# Altium schematic sheet Sheet1.SchDoc
size A3; SheetNumber: 1; SheetTotal: 2
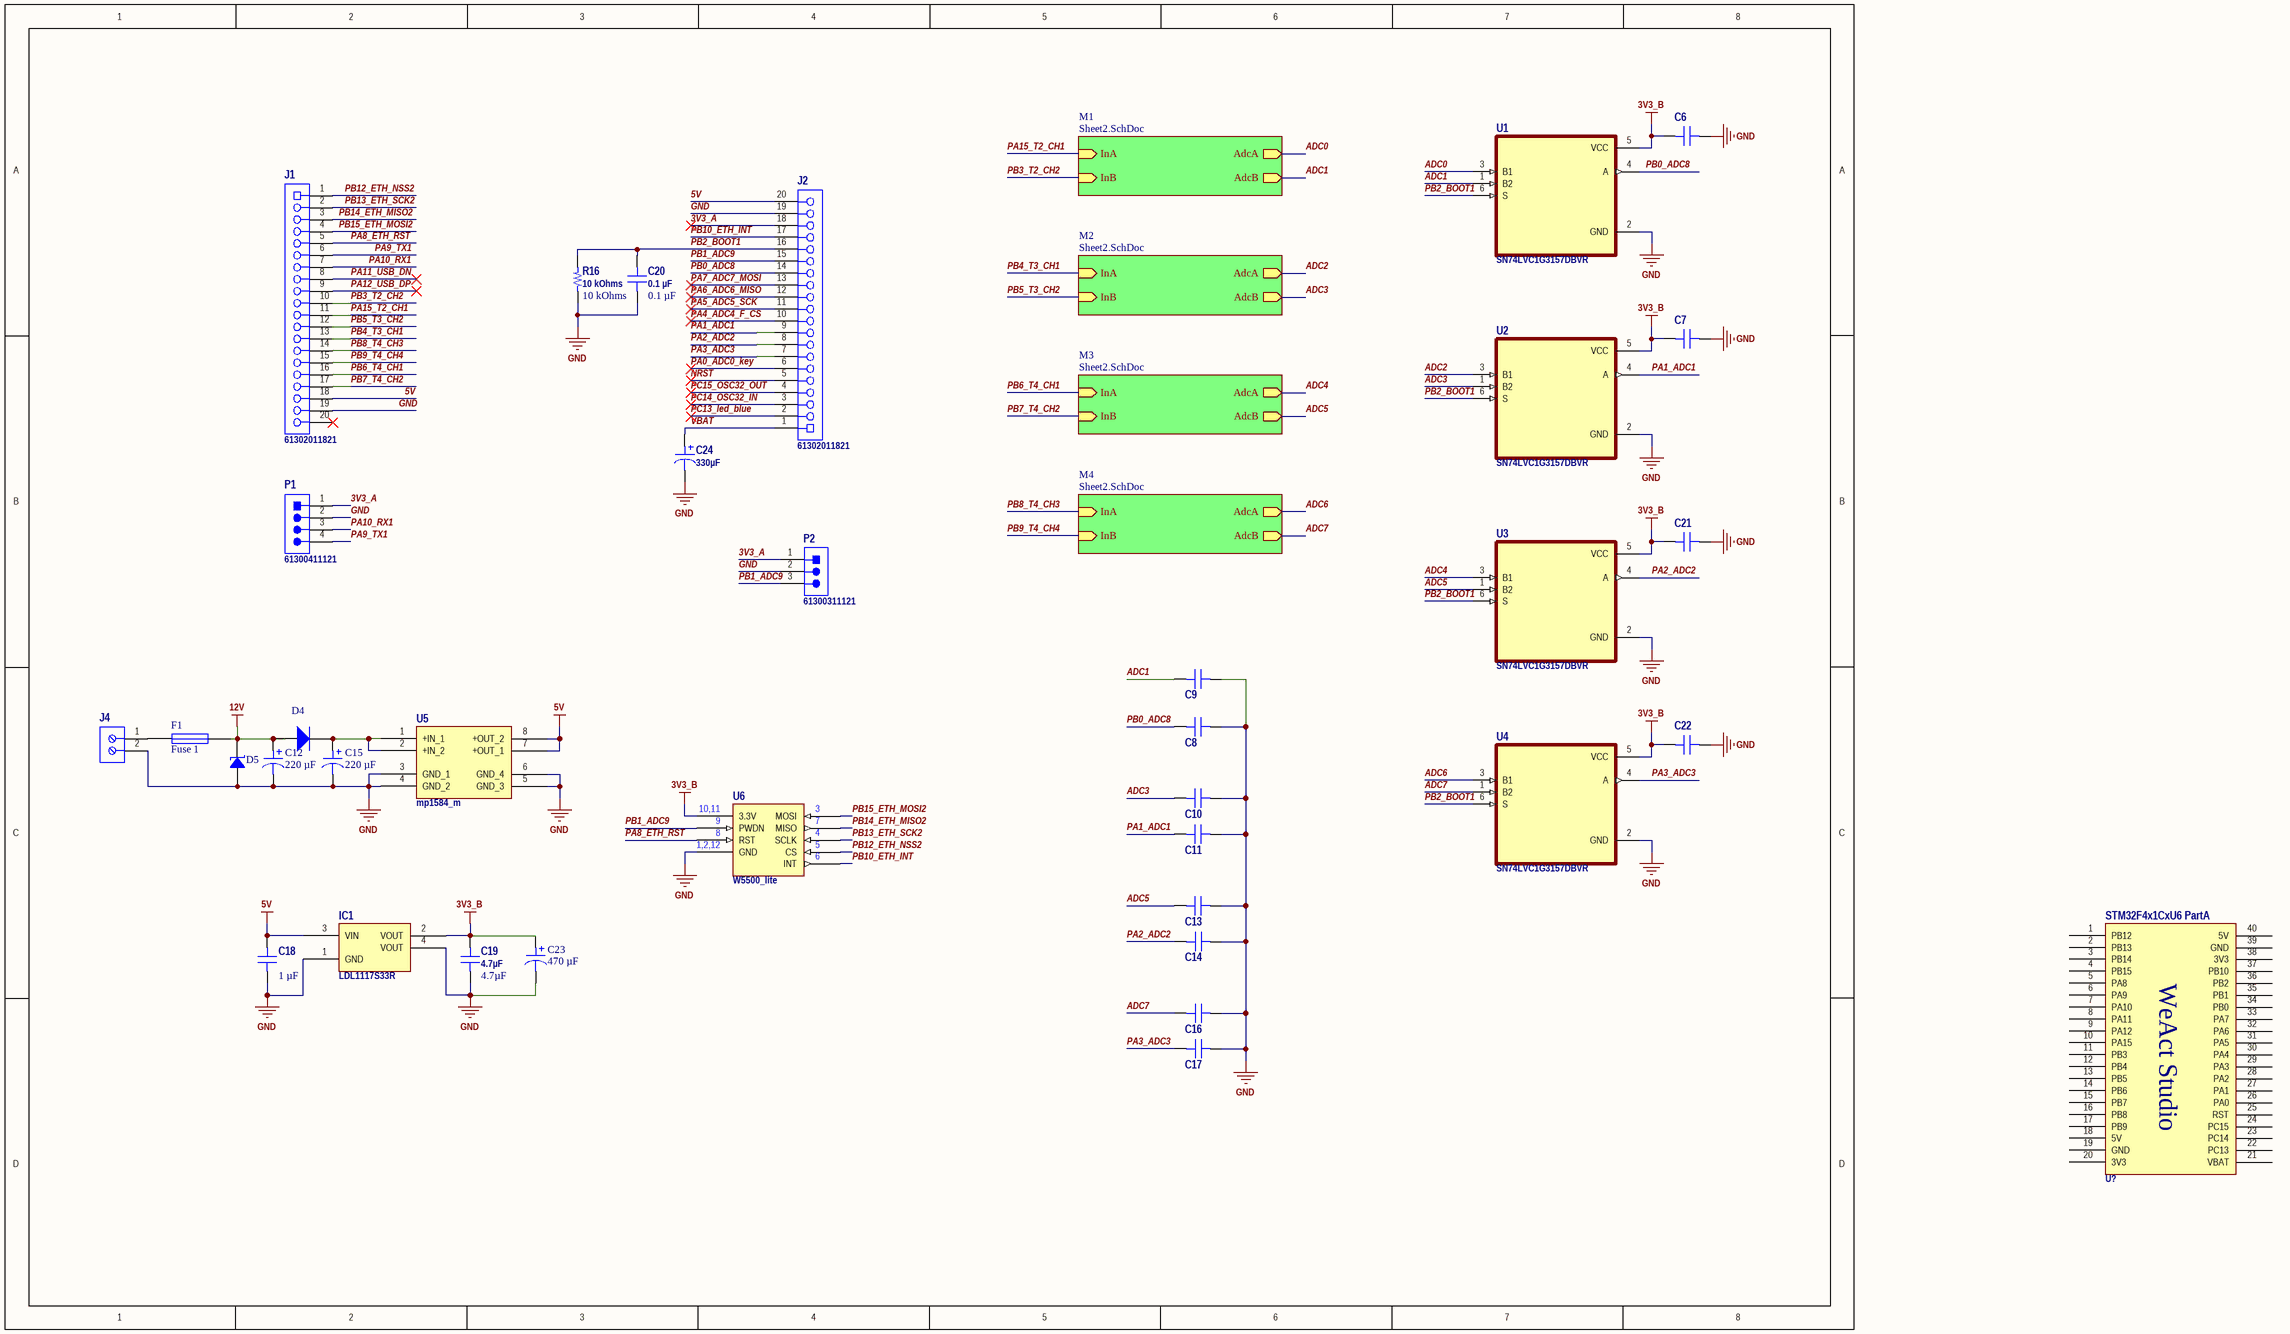
[diagram p0: Sheet1.SchDoc]

## Parts
C6  1000 pF  [CAP 0603_1608]  (value not drawn)
C7  1000 pF  [CAP 0603_1608]  (value not drawn)
C8  0.1 µF  [CAP 0603_1608]  (value not drawn)
C9  0.1 µF  [CAP 0603_1608]  (value not drawn)
C10  0.1 µF  [CAP 0603_1608]  (value not drawn)
C11  0.1 µF  [CAP 0603_1608]  (value not drawn)
C12  220 µF  [CAP AL TH D8 L3.5 H12.5]
C13  0.1 µF  [CAP 0603_1608]  (value not drawn)
C14  0.1 µF  [CAP 0603_1608]  (value not drawn)
C15  220 µF  [CAP AL TH D8 L3.5 H12.5]
C16  0.1 µF  [CAP 0603_1608]  (value not drawn)
C17  0.1 µF  [CAP 0603_1608]  (value not drawn)
C18  1 µF  [CAP 0805_2012]
C19  4.7µF  [CAP 0805_2012]
C20  0.1 µF  [CAP 0603_1608]
C21  1000 pF  [CAP 0603_1608]  (value not drawn)
C22  1000 pF  [CAP 0603_1608]  (value not drawn)
C23  470 µF  [CAP AL TH D8 L3.5 H12.5]
C24  330µF  [CAP POL 2917_7343]
D4  Diode 1N5400  [DO-201AD]  (value not drawn)
D5  SMBJ120A  [DO214AA SMB]  (value not drawn)
F1  Fuse 1  [PIN-W2/E2.8]
IC1  LDL1117S33R  [ST SOT-223]
J1  61302011821  [61302011821]
J2  61302011821  [61302011821]
J4  691102710002  [691102710002]  (value not drawn)
P1  61300411121  [61300411121]
P2  61300311121  [61300311121]
R16  10 kOhms  [RES 0805_2012]
STM32F4x1CxU6_Part  U?  [STM32F4x1CxU6 WeActStudio]  (part A of 2)
U1  SN74LVC1G3157DBVR  [SOT95P280X145-6N]
U2  SN74LVC1G3157DBVR  [SOT95P280X145-6N]
U3  SN74LVC1G3157DBVR  [SOT95P280X145-6N]
U4  SN74LVC1G3157DBVR  [SOT95P280X145-6N]
U5  mp1584_m  [modul]
U6  W5500_lite  [VAD USR-ES1 W5500]

## Sub-sheets
M1 = Sheet2.SchDoc: InA (in), InB (in), AdcB (out), AdcA (out)
M2 = Sheet2.SchDoc: InA (in), InB (in), AdcB (out), AdcA (out)
M3 = Sheet2.SchDoc: InA (in), InB (in), AdcB (out), AdcA (out)
M4 = Sheet2.SchDoc: InA (in), InB (in), AdcB (out), AdcA (out)

## Nets
3V3_B: C6.2 C7.2 C19.2 C21.2 C22.2 C23.1 IC1.2(VOUT) U1.5(VCC) U2.5(VCC) U3.5(VCC) U4.5(VCC) U6.10,11(3.3V)
5V: C18.2 IC1.3(VIN) J1.18 J2.20 U5.7(+OUT_1) U5.8(+OUT_2)
12V: C12.1 D4.1(A) D5.2 F1.2
GND: C6.1 C7.1 C8.2 C9.2 C10.2 C11.2 C12.2 C13.2 C14.1 C15.2 C16.1 C17.1 C18.1 C19.1 C20.2 C21.1 C22.1 C23.2 C24.2 D5.1 IC1.1(GND) IC1.4(VOUT) J1.19 J2.19 J4.2 P1.2 P2.2 R16.1 U1.2(GND) U2.2(GND) U3.2(GND) U4.2(GND) U5.3(GND_1) U5.4(GND_2) U5.5(GND_3) U5.6(GND_4) U6.1,2,12(GND)
3V3_A: J2.18 P1.1 P2.1
ADC0: U1.3(B1) ; sheet M1/AdcA
ADC1: C9.1 U1.1(B2) ; sheet M1/AdcB
ADC2: U2.3(B1) ; sheet M2/AdcA
ADC3: C10.1 U2.1(B2) ; sheet M2/AdcB
ADC4: U3.3(B1) ; sheet M3/AdcA
ADC5: C13.1 U3.1(B2) ; sheet M3/AdcB
ADC6: U4.3(B1) ; sheet M4/AdcA
ADC7: C16.2 U4.1(B2) ; sheet M4/AdcB
NRST: J2.5
PA0_ADC0_key: J2.6
PA1_ADC1: C11.1 J2.9 U2.4(A)
PA2_ADC2: C14.2 J2.8 U3.4(A)
PA3_ADC3: C17.2 J2.7 U4.4(A)
PA4_ADC4_F_CS: J2.10
PA5_ADC5_SCK: J2.11
PA6_ADC6_MISO: J2.12
PA7_ADC7_MOSI: J2.13
PA8_ETH_RST: J1.5 U6.8(RST)
PA9_TX1: J1.6 P1.4
PA10_RX1: J1.7 P1.3
PA11_USB_DN: J1.8
PA12_USB_DP: J1.9
PA15_T2_CH1: J1.11 ; sheet M1/InA
PB0_ADC8: C8.1 J2.14 U1.4(A)
PB1_ADC9: J2.15 P2.3 U6.9(PWDN)
PB2_BOOT1: C20.1 J2.16 R16.2 U1.6(S) U2.6(S) U3.6(S) U4.6(S)
PB3_T2_CH2: J1.10 ; sheet M1/InB
PB4_T3_CH1: J1.13 ; sheet M2/InA
PB5_T3_CH2: J1.12 ; sheet M2/InB
PB6_T4_CH1: J1.16 ; sheet M3/InA
PB7_T4_CH2: J1.17 ; sheet M3/InB
PB8_T4_CH3: J1.14 ; sheet M4/InA
PB9_T4_CH4: J1.15 ; sheet M4/InB
PB10_ETH_INT: J2.17 U6.6(INT)
PB12_ETH_NSS2: J1.1 U6.5(CS)
PB13_ETH_SCK2: J1.2 U6.4(SCLK)
PB14_ETH_MISO2: J1.3 U6.7(MISO)
PB15_ETH_MOSI2: J1.4 U6.3(MOSI)
PC13_led_blue: J2.2
PC14_OSC32_IN: J2.3
PC15_OSC32_OUT: J2.4
VBAT: C24.1 J2.1
NetC15_1: C15.1 D4.2(K) U5.1(+IN_1) U5.2(+IN_2)
NetF1_1: F1.1 J4.1

Not connected (* = marked no-connect by the designer): J1 20*; STM32F4x1CxU6_Part 1(PB12) 2(PB13) 3(PB14) 4(PB15) 5(PA8) 6(PA9) 7(PA10) 8(PA11) 9(PA12) 10(PA15) 11(PB3) 12(PB4) 13(PB5) 14(PB6) 15(PB7) 16(PB8) 17(PB9) 18(5V) 19(GND) 20(3V3) 21(VBAT) 22(PC13) 23(PC14) 24(PC15) 25(RST) 26(PA0) 27(PA1) 28(PA2) 29(PA3) 30(PA4) 31(PA5) 32(PA6) 33(PA7) 34(PB0) 35(PB1) 36(PB2) 37(PB10) 38(3V3) 39(GND) 40(5V)

## Library data of the parts
C6 C7 C21 C22 = CC0603JPX7R9BB102: CAP CER 1000PF 50V X7R 0603; manufacturer: Yageo; Tolerance: ±5%; Part Number: CC0603JPX7R9BB102; Value: 1000 pF; Applications: General Purpose; Capacitance: 1000 pF; componentlink1description: Datasheet; componentlink1url: https://www.yageo.com/upload/media/product/productsearch/datasheet/mlcc/UPY-GPHC_X7R_6.3V-to-50V_20.pdf; componentlink2description: DigiKey Link; componentlink2url: https://www.digikey.com/en/products/detail/yageo/CC0603JPX7R9BB102/11490764; Device Package: 0603 (1608 Metric); lastupdated: 26.02.2022 9:05:02; Lifecycle Status: Active; Minimum Order: 1; Mounting Type: Surface Mount, MLCC; Operating Temperature: -55°C ~ 125°C; Package / Case: 0603 (1608 Metric); packaging: TapeAndReel; partid: 35065; Part Status: Active; price: 0.01; series: CC; Size / Dimension: 0.063" L x 0.031" W (1.60mm x 0.80mm); Supplier 1: DigiKey; Supplier Part Number 1: 13-CC0603JPX7R9BB102CT-ND; Temperature Coefficient: X7R; Thickness (Max): 0.035" (0.90mm); Voltage - Rated: 50V
C8-C11 C13 C14 C16 C17 = CC0603KPX7R8BB104: CAP CER 0.1UF 25V X7R 0603; manufacturer: Yageo; Tolerance: ±10%; Part Number: CC0603KPX7R8BB104; Value: 0.1 µF; Applications: General Purpose; Capacitance: 0.1 µF; componentlink1description: Datasheet; componentlink1url: https://www.yageo.com/upload/media/product/productsearch/datasheet/mlcc/UPY-GPHC_X7R_6.3V-to-50V_20.pdf; componentlink2description: DigiKey Link; componentlink2url: https://www.digikey.com/en/products/detail/yageo/CC0603KPX7R8BB104/11491262; Device Package: 0603 (1608 Metric); lastupdated: 06.03.2022 13:58:12; Lifecycle Status: Active; Minimum Order: 1; Mounting Type: Surface Mount, MLCC; Operating Temperature: -55°C ~ 125°C; Package / Case: 0603 (1608 Metric); packaging: TapeAndReel; partid: 35805; Part Status: Active; price: 0.01; series: CC; Size / Dimension: 0.063" L x 0.031" W (1.60mm x 0.80mm); Supplier 1: DigiKey; Supplier Part Number 1: 13-CC0603KPX7R8BB104CT-ND; Temperature Coefficient: X7R; Thickness (Max): 0.035" (0.90mm); Voltage - Rated: 25V
C12 C15 = ESW227M025AG3AA: CAP ALUM 220UF 20% 25V RADIAL; manufacturer: KEMET; ESR (Equivalent Series Resistance): 117mOhm @ 100kHz; Impedance: 117 mOhms; Lifetime @ Temp.: 4000 Hrs @ 105°C; Polarization: Polar; Ripple Current @ High Frequency: 640 mA @ 100 kHz; Ripple Current @ Low Frequency: 320 mA @ 120 Hz; Part Number: ESW227M025AG3AA; Applications: General Purpose; Capacitance: 220 µF; componentlink1description: Datasheet; componentlink1url: https://api.kemet.com/component-edge/download/datasheet/ESW227M025AG3AA.pdf; componentlink2description: DigiKey Link; componentlink2url: https://www.digikey.com/en/products/detail/kemet/ESW227M025AG3AA/2712542; Device Package: Radial, Can; Height - Seated (Max): 0.492" (12.50mm); lastupdated: 11.07.2022 15:34:44; Lead Spacing: 0.138" (3.50mm); Lifecycle Status: Active; Minimum Order: 1; Mounting Type: Through Hole; Operating Temperature: -40°C ~ 105°C; Package / Case: Radial, Can; packaging: Bulk; partid: 7223; Part Status: Active; price: 0.12; series: ESW; Size / Dimension: 0.315" Dia (8.00mm); Supplier 1: DigiKey; Supplier Part Number 1: 399-6112-ND; Tolerance: ±20%; value: 220 µF; Voltage - Rated: 25 V
C18 = CL21B105KBFNNNE: CAP CER 1UF 50V X7R 0805; manufacturer: Samsung Electro-Mechanics; Tolerance: ±10%; Part Number: CL21B105KBFNNNE; Value: 1 µF; Applications: General Purpose; Capacitance: 1 µF; componentlink1description: Datasheet; componentlink1url: http://www.samsungsem.com/kr/support/product-search/mlcc/CL21B105KBFNNNE.jsp; componentlink2description: DigiKey Link; componentlink2url: https://www.digikey.com/en/products/detail/samsung-electro-mechanics/CL21B105KBFNNNE/3886687; Device Package: 0805 (2012 Metric); lastupdated: 27.06.2022 11:05:28; Lifecycle Status: Active; Minimum Order: 1; Mounting Type: Surface Mount, MLCC; Operating Temperature: -55°C ~ 125°C; Package / Case: 0805 (2012 Metric); packaging: TapeAndReel; partid: 39620; Part Status: Active; price: 0.02; series: CL; Size / Dimension: 0.079" L x 0.049" W (2.00mm x 1.25mm); Supplier 1: DigiKey; Supplier Part Number 1: 1276-1029-1-ND; Temperature Coefficient: X7R; Thickness (Max): 0.053" (1.35mm); Voltage - Rated: 50V
C19 = 08056D475KAT2A: CAP CER 4.7UF 6.3V X5R 0805; manufacturer: AVX Corporation; Tolerance: ±10%; Part Number: 08056D475KAT2A; Value: 4.7µF; Applications: General Purpose; Capacitance: 4.7µF; componentlink1description: Datasheet; componentlink1url: http://datasheets.avx.com/cx5r.pdf; componentlink2description: DigiKey Link; componentlink2url: http://digikey.com/product-detail/en/avx-corporation/08056D475KAT2A/478-1416-1-ND/564448; Device Package: 0805 (2012 Metric); lastupdated: 02.09.2020 1:04:16; Lifecycle Status: Active; Minimum Order: 1; Mounting Type: Surface Mount, MLCC; Operating Temperature: -55°C ~ 85°C; Package / Case: 0805 (2012 Metric); packaging: TapeAndReel; partid: 15246; Part Status: Active; price: 0.13; series: -; Size / Dimension: 0.079" L x 0.049" W (2.01mm x 1.25mm); Supplier 1: DigiKey; Supplier Part Number 1: 478-1416-1-ND; Temperature Coefficient: X5R; Thickness (Max): 0.055" (1.40mm); Voltage - Rated: 6.3V
C20 = CS0603KRX7R7BB104: CAP CER 0.1UF 16V X7R 0603; manufacturer: Yageo; Tolerance: ±10%; Part Number: CS0603KRX7R7BB104; Value: 0.1 µF; Applications: Boardflex Sensitive; Capacitance: 0.1 µF; componentlink1description: Datasheet; componentlink1url: http://www.yageo.com/NewPortal/yageodocoutput?fileName=/pdf/MLCC/UPY-ST_NPOX7R_16V-to-3KV_5.pdf; componentlink2description: DigiKey Link; componentlink2url: https://www.digikey.com/en/products/detail/yageo/CS0603KRX7R7BB104/6097897; Device Package: 0603 (1608 Metric); Features: Soft Termination; lastupdated: 30.06.2022 22:03:44; Lifecycle Status: Active; Minimum Order: 1; Mounting Type: Surface Mount, MLCC; Operating Temperature: -55°C ~ 125°C; Package / Case: 0603 (1608 Metric); packaging: TapeAndReel; partid: 2286; Part Status: Active; price: 0.02; series: CS; Size / Dimension: 0.063" L x 0.031" W (1.60mm x 0.80mm); Supplier 1: DigiKey; Supplier Part Number 1: 311-3560-1-ND; Temperature Coefficient: X7R; Thickness (Max): 0.037" (0.95mm); Voltage - Rated: 16V
C23 = ESH477M010AG3AA: CAP ALUM 470UF 20% 10V RADIAL; manufacturer: KEMET; Lifetime @ Temp.: 2000 Hrs @ 105°C; Polarization: Polar; Ripple Current @ High Frequency: 457.5 mA @ 10 kHz; Ripple Current @ Low Frequency: 305 mA @ 120 Hz; Part Number: ESH477M010AG3AA; Applications: General Purpose; Capacitance: 470 µF; componentlink1description: Datasheet; componentlink1url: https://api.kemet.com/component-edge/download/datasheet/ESH477M010AG3AA.pdf; componentlink2description: DigiKey Link; componentlink2url: https://www.digikey.com/en/products/detail/kemet/ESH477M010AG3AA/13176193; Height - Seated (Max): 0.492" (12.50mm); lastupdated: 11.07.2022 15:34:42; Lead Spacing: 0.138" (3.50mm); Lifecycle Status: Active; Minimum Order: 1; Mounting Type: Through Hole; Operating Temperature: -40°C ~ 105°C; packaging: Box; partid: 27002; Part Status: Active; price: 0.08; series: ESH; Size / Dimension: 0.315" Dia (8.00mm); Supplier 1: DigiKey; Supplier Part Number 1: 399-ESH477M010AG3AA-ND; Tolerance: ±20%; value: 470 µF; Voltage - Rated: 10 V
C24 = T530X337M010AHE010: CAP TANT POLY 330UF 10V 2917; manufacturer: KEMET; Manufacturer Size Code: X; Tolerance: ±20%; ESR (Equivalent Series Resistance): 10mOhm @ 100kHz; Lifetime @ Temp.: 2000 Hrs @ 105°C; Type: Molded; Part Number: T530X337M010AHE010; Value: 330µF; Capacitance: 330µF; componentlink1description: Datasheet; componentlink1url: https://content.kemet.com/datasheets/KEM_T2076_T52X-530.pdf; componentlink2description: DigiKey Link; componentlink2url: http://digikey.com/product-detail/en/kemet/T530X337M010AHE010/399-10377-1-ND/3760458; Device Package: 2917 (7343 Metric); lastupdated: 02.09.2020 1:16:50; Lifecycle Status: Active; Minimum Order: 1; Mounting Type: Surface Mount; Operating Temperature: -55°C ~ 125°C; Package / Case: 2917 (7343 Metric); packaging: TapeAndReel; partid: 825; Part Status: Active; price: 3.55; series: KO-CAP® T530; Size / Dimension: 0.287" L x 0.169" W (7.30mm x 4.30mm); Supplier 1: DigiKey; Supplier Part Number 1: 399-10377-1-ND; Voltage - Rated: 10V; Features: General Purpose; Height - Seated (Max): 0.169" (4.30mm)
D4 = Diode 1N5400: 3 Amp General Purpose Rectifier; ComponentLink1Description: Manufacturer Link; ComponentLink1URL: http://www.fairchildsemi.com/; ComponentLink2Description: Datasheet; ComponentLink2URL: http://www.fairchildsemi.com/ds/1N%2F1N5400.pdf; Published: 8-Jun-2000; LatestRevisionDate: 17-Jul-2002; LatestRevisionNote: Re-released for DXP Platform.; DatasheetVersion: 1998; PackageVersion: Aug-1999; PackageReference: DO-201AD; Publisher: Altium Limited; PackageDescription: Diode, Axial; Body 9.5 x 5.6 mm (LxDia. max), Lead Dia. 1.32 mm (max)
D5 = SMBJ120A: TVS DIODE 120VWM 193VC DO214AA; Manufacturer: Taiwan Semiconductor Corporation; Current - Peak Pulse (10/1000µs): 3.1A; Power Line Protection: No; Power - Peak Pulse: 600W; Type: Zener; Unidirectional Channels: 1; Voltage - Breakdown (Min): 133V; Voltage - Clamping (Max) @ Ipp: 193V; Voltage - Reverse Standoff (Typ): 120V; Part Number: SMBJ120A; Applications: General Purpose; ComponentLink1Description: Datasheet; ComponentLink1URL: https://www.taiwansemi.com/products/datasheet/SMBJ%20SERIES_P1812.pdf; ComponentLink2Description: DigiKey Link; ComponentLink2URL: https://www.digikey.com/en/products/detail/taiwan-semiconductor-corporation/SMBJ120A/1049541; LastUpdated: 11.07.2022 15:29:50; Lifecycle Status: Active; Minimum Order: 1; Mounting Type: Surface Mount; Operating Temperature: -55°C ~ 150°C (TJ); Package / Case: DO-214AA, SMB; Packaging: TapeAndReel; PartId: 10713; Part Status: Active; Price: 0.26; Series: SMBJ; Supplier 1: DigiKey; Supplier Part Number 1: SMBJ120AFSCT-ND; Supplier Device Package: DO-214AA (SMB)
F1 = Fuse 1: Fuse; Published: 8-Jun-2000; LatestRevisionDate: 17-Jul-2002; LatestRevisionNote: Re-released for DXP Platform.; PackageReference: PIN-W2/E2.8; Publisher: Altium Limited; PackageDescription: Thru-Hole; 2 Leads
IC1 = LD1117AS33TR: IC REG LINEAR 3.3V 1A SOT223; Manufacturer: STMicroelectronics; Current - Quiescent (Iq): 10 mA; Number of Regulators: 1; Output Configuration: Positive; Output Type: Fixed; Protection Features: Over Current, Over Temperature; PSRR: 75dB (120Hz); Voltage Dropout (Max): 1.3V @ 1A; Voltage - Input (Max): 15V; Part Number: LD1117AS33TR; ComponentLink1Description: Datasheet; ComponentLink1URL: http://www.st.com/content/ccc/resource/technical/document/datasheet/a5/c3/3f/c9/2b/15/40/49/CD00002116.pdf/files/CD00002116.pdf/jcr:content/translations/en.CD00002116.pdf; ComponentLink2Description: DigiKey Link; ComponentLink2URL: https://www.digikey.com/en/products/detail/stmicroelectronics/LD1117AS33TR/585752; Current - Output: 1A; LastUpdated: 27.06.2022 11:57:05; Lifecycle Status: Active; Minimum Order: 1; Mounting Type: Surface Mount; Operating Temperature: 0°C ~ 125°C; Package / Case: TO-261-4, TO-261AA; Packaging: TapeAndReel; Part Status: Active; Price: 0.45; Series: -; Supplier 1: DigiKey; Supplier Part Number 1: 497-1228-1-ND; Supplier Device Package: SOT-223; Voltage - Output (Min/Fixed): 3.3V
J1 J2 = 61302011821: WR-PHD Socket Header, THT, pitch 2.54mm, Single Row, Vertical, 20p; Manufacturer: Wurth Elektronik; Pin Number: 20; Rated Current: 3A; Working Voltage: 250VAC; Withstanding Voltage: 500VAC; Contact Resistance: 20mOhm; ComponentLink1Description: Manufacturer; ComponentLink1URL: http://www.we-online.de; ComponentLink2Description: Datasheet; ComponentLink2URL: https://www.we-online.com/catalog/datasheet/61302011821.pdf; Manufacturer Part Number: 61302011821; Pitch: 2.54mm; Operating Temperature: -40 to +125degC; Mounting Technology: THT; Packaging: Tray; Gender: Socket Header; Row Number: Single; Orientation: Vertical
J4 = 691102710002: WR-TBL Serie 102 Horizontal Entry Modular, Pressure Clamp, THT, pitch 5mm, 2p; Manufacturer: Wurth Elektronik; Modularity: Yes; PCB/Cable/Panel: PCB; Pin Number: 2; Rated Current [UL]: 15A; Working Voltage [UL]: 250VAC; ComponentLink1Description: Manufacturer; ComponentLink1URL: http://www.we-online.de; ComponentLink2URL: https://katalog.we-online.de/em/datasheet/691102710002.pdf; ComponentLink2Description: Datasheet; Mounting Technology: THT; Manufacturer Part Number: 691102710002; Packaging: Box; Operating Temperature: -40 to +105degC; Pitch: 5mm; Published Date: Feburary 2021; Type: Horizontal; Application: Pressure Clamp
P1 = 61300411121: WR-PHD Pin Header, THT, pitch 2.54mm, Single Row, Vertical, 4p; Manufacturer: Wurth Elektronik; Pin Number: 4; Rated Current: 3A; Working Voltage: 250VAC; Withstanding Voltage: 500VAC; Contact Resistance: 20mOhm; ComponentLink1Description: Manufacturer; ComponentLink1URL: http://www.we-online.de; ComponentLink2Description: Datasheet; ComponentLink2URL: https://www.we-online.com/catalog/datasheet/61300411121.pdf; Manufacturer Part Number: 61300411121; Pitch: 2.54mm; Operating Temperature: -40 to +105degC; Mounting Technology: THT; Packaging: Bag; Gender: Pin Header; Row Number: Single; Orientation: Vertical
P2 = 61300311121: WR-PHD Pin Header, THT, pitch 2.54mm, Single Row, Vertical, 3p; Manufacturer: Wurth Elektronik; Pin Number: 3; Rated Current: 3A; Working Voltage: 250VAC; Withstanding Voltage: 500VAC; Contact Resistance: 20mOhm; ComponentLink1Description: Manufacturer; ComponentLink1URL: http://www.we-online.de; ComponentLink2Description: Datasheet; ComponentLink2URL: https://www.we-online.com/catalog/datasheet/61300311121.pdf; Manufacturer Part Number: 61300311121; Pitch: 2.54mm; Operating Temperature: -40 to +105degC; Mounting Technology: THT; Packaging: Bag; Gender: Pin Header; Row Number: Single; Orientation: Vertical
R16 = RC0805JR-0710KL: RES 10K OHM 5% 1/8W 0805; Manufacturer: Yageo; Power (Watts): 0.125W, 1/8W; Temperature Coefficient: ±100ppm/°C; Part Number: RC0805JR-0710KL; Value: 10 kOhms; ComponentLink1Description: Datasheet; ComponentLink1URL: https://www.yageo.com/upload/media/product/productsearch/datasheet/rchip/PYu-RC_Group_51_RoHS_L_10.pdf; ComponentLink2Description: DigiKey Link; ComponentLink2URL: https://www.digikey.com/en/products/detail/yageo/RC0805JR-0710KL/728241; Composition: Thick Film; Device Package: 0805 (2012 Metric); Features: Moisture Resistant; Height - Seated (Max): 0.024" (0.60mm); LastUpdated: 30.06.2022 22:38:47; Lifecycle Status: Active; Minimum Order: 1; Number of Terminations: 2; Operating Temperature: -55°C ~ 155°C; Package / Case: 0805 (2012 Metric); Packaging: CutTape; PartId: 38737; Part Status: Active; Price: 0.01; Resistance: 10 kOhms; Series: RC_L; Size / Dimension: 0.079" L x 0.049" W (2.00mm x 1.25mm); Supplier 1: DigiKey; Supplier Part Number 1: 311-10KARCT-ND; Supplier Device Package: 0805; Tolerance: ±5%
STM32F4x1CxU6_Part = STM32F4x1CxU6 WeActStudio: STM32F4x1CxU6; ComponentLink1Description: WeAct Studio; ComponentLink1URL: WeAct-TC.cn; ComponentLink2Description: MiniF4-STM32F4x1 Github; ComponentLink2URL: https://github.com/WeActTC/MiniF4-STM32F4x1; ComponentLink3Description: MiniF4-STM32F4x1 Gitee; ComponentLink3URL: https://gitee.com/WeAct-TC/MiniF4-STM32F4x1
U1-U4 = SN74LVC1G3157DBVR: 5-V, 2:1 (SPDT), 1-channel general-purpose analog switch 6-SOT-23 -40 to 125; MF: Texas Instruments; Price: None; Value: *; Package: SOT-23-6 Texas Instruments; Mouser-Purchase-URL: https://snapeda.com/shop?store=Mouser&id=366071; SnapEDA_Link: https://www.snapeda.com/parts/SN74LVC1G3157DBVR/Texas%20Instruments/view-part/366071/?ref=snap; DigiKey-Purchase-URL: https://snapeda.com/shop?store=DigiKey&id=366071; Arrow_Electronics-Purchase-URL: https://snapeda.com/shop?store=Arrow+Electronics&id=366071; MP: SN74LVC1G3157DBVR; Texas_Instruments-Purchase-URL: https://snapeda.com/shop?store=Texas+Instruments&id=366071; Availability: Good; Check_prices: https://www.snapeda.com/parts/SN74LVC1G3157DBVR/Texas%20Instruments/view-part/366071/?ref=eda
U6 = W5500_lite: W5500 Lite ethernet board